# EAGLE design Parasite (EAGLE 9.6.2)
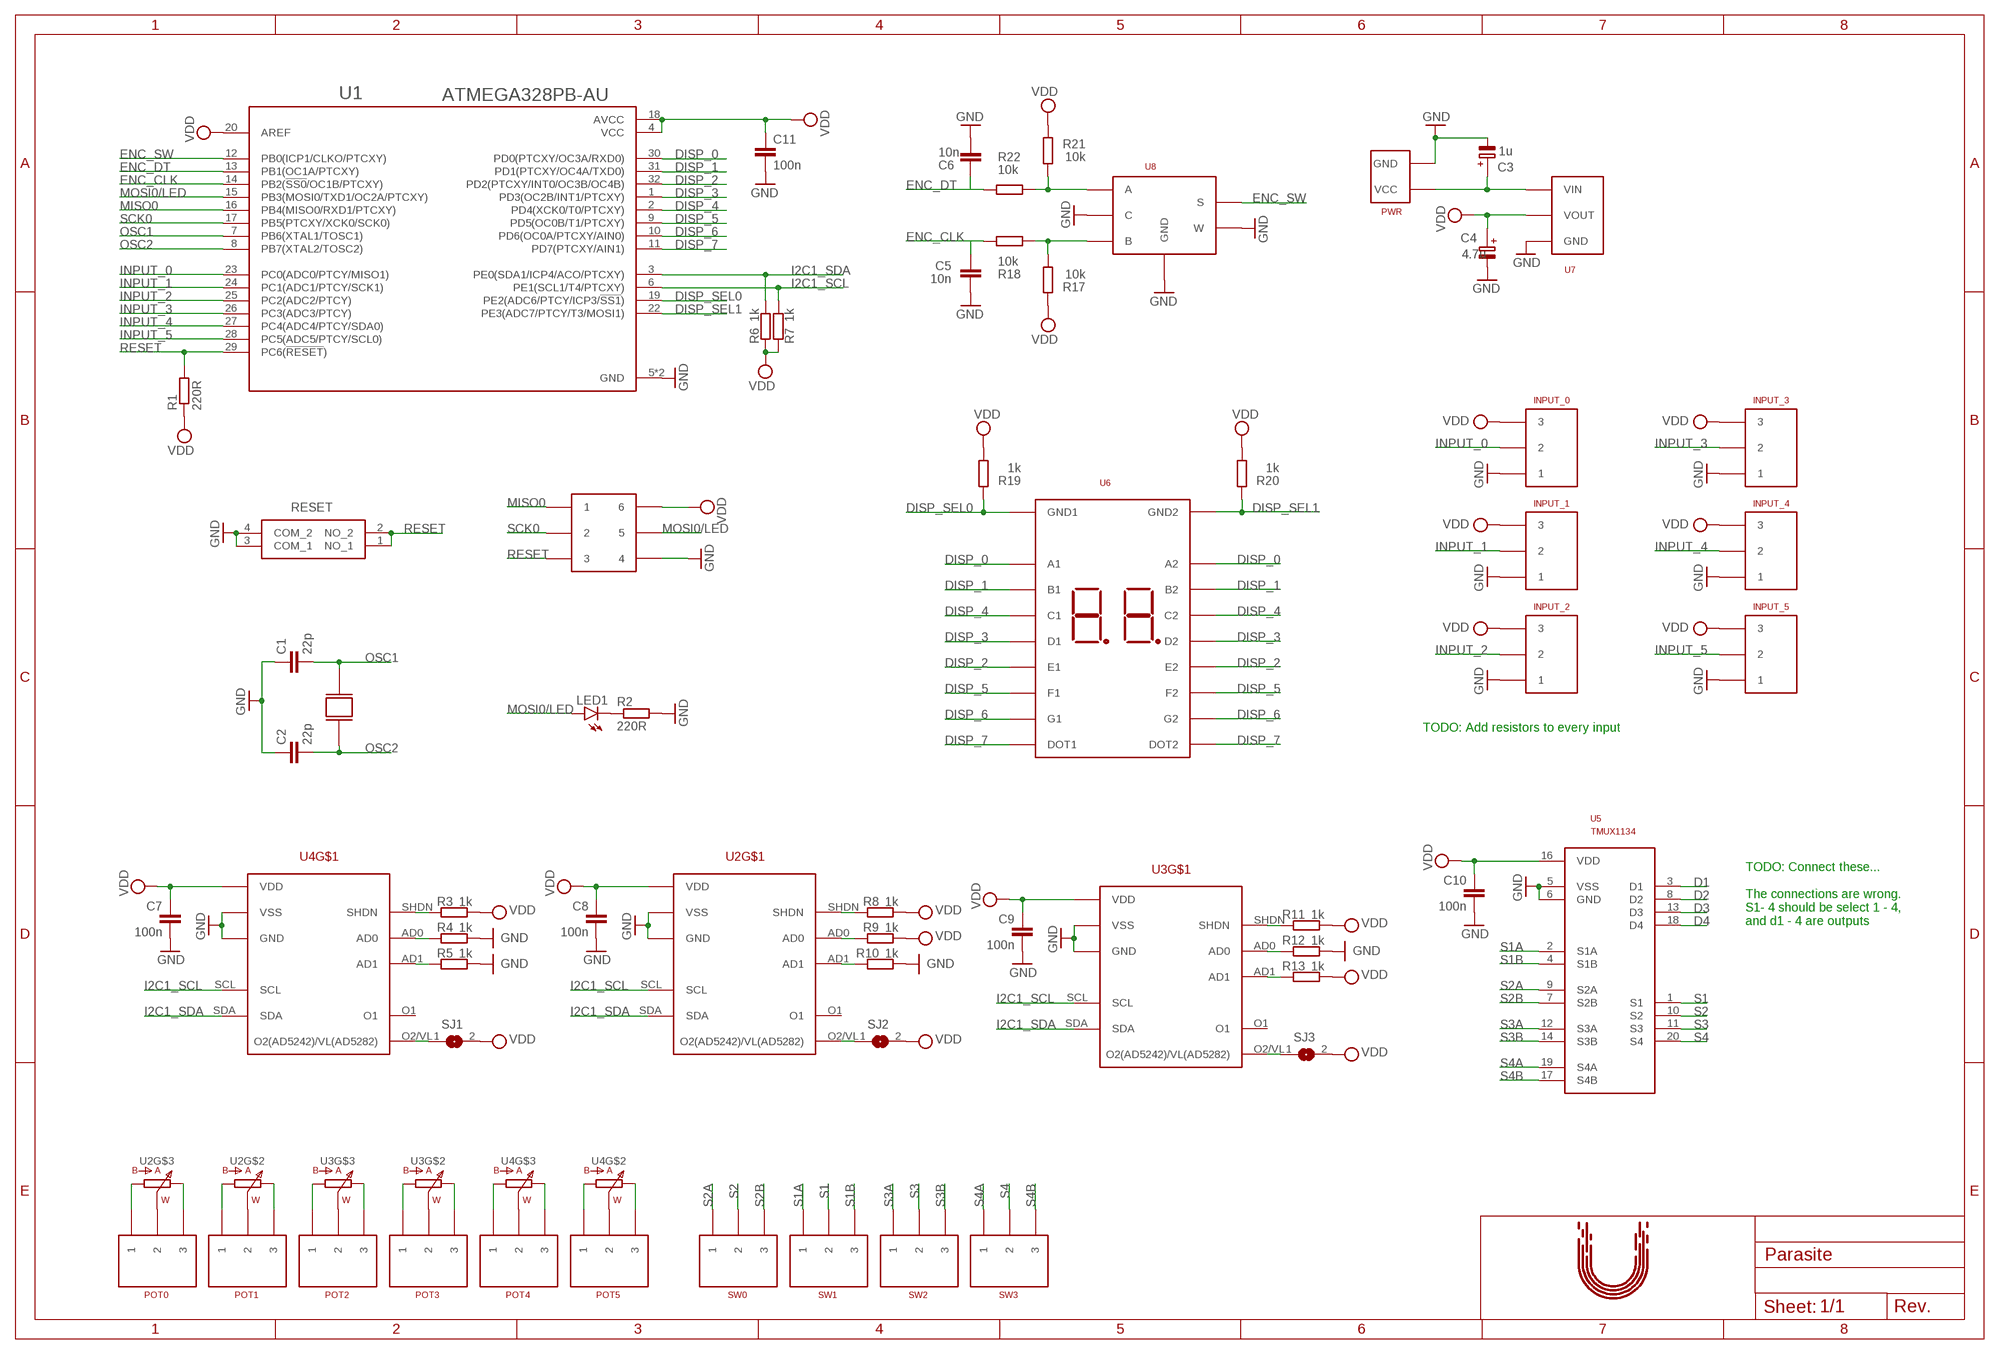
[diagram p0: schematic, sheet 1]

## Parts
C1  22p  CAPACITOR1206  [C-1206]
C2  22p  CAPACITOR1206  [C-1206]
C3  1u  ELECT_CAPACITORCAP6  [UD-4X5,8_NICHICON]
C4  4.7u  ELECT_CAPACITORCAP6  [UD-4X5,8_NICHICON]
C5  10n  CAPACITOR1206  [C-1206]
C6  10n  CAPACITOR1206  [C-1206]
C7  100n  CAPACITOR1206  [C-1206]
C8  100n  CAPACITOR1206  [C-1206]
C9  100n  CAPACITOR1206  [C-1206]
C10  100n  CAPACITOR1206  [C-1206]
C11  100n  CAPACITOR1206  [C-1206]
INPUT_0  3_PIN_CONNECTOR  [3_PIN_CONNECTOR]
INPUT_1  3_PIN_CONNECTOR  [3_PIN_CONNECTOR]
INPUT_2  3_PIN_CONNECTOR  [3_PIN_CONNECTOR]
INPUT_3  3_PIN_CONNECTOR  [3_PIN_CONNECTOR]
INPUT_4  3_PIN_CONNECTOR  [3_PIN_CONNECTOR]
INPUT_5  3_PIN_CONNECTOR  [3_PIN_CONNECTOR]
LED1  LEDLED_THROUGH  [LED3MM]
POT0  3_PIN_CONNECTOR  [3_PIN_CONNECTOR]
POT1  3_PIN_CONNECTOR  [3_PIN_CONNECTOR]
POT2  3_PIN_CONNECTOR  [3_PIN_CONNECTOR]
POT3  3_PIN_CONNECTOR  [3_PIN_CONNECTOR]
POT4  3_PIN_CONNECTOR  [3_PIN_CONNECTOR]
POT5  3_PIN_CONNECTOR  [3_PIN_CONNECTOR]
PWR  PWR  [PWR]
R1  220R  RESISTOR1206  [R1206]
R2  220R  RESISTOR1206  [R1206]
R3  1k  RESISTOR1206  [R1206]
R4  1k  RESISTOR1206  [R1206]
R5  1k  RESISTOR1206  [R1206]
R6  1k  RESISTOR1206  [R1206]
R7  1k  RESISTOR1206  [R1206]
R8  1k  RESISTOR1206  [R1206]
R9  1k  RESISTOR1206  [R1206]
R10  1k  RESISTOR1206  [R1206]
R11  1k  RESISTOR1206  [R1206]
R12  1k  RESISTOR1206  [R1206]
R13  1k  RESISTOR1206  [R1206]
R17  10k  RESISTOR1206  [R1206]
R18  10k  RESISTOR1206  [R1206]
R19  1k  RESISTOR1206  [R1206]
R20  1k  RESISTOR1206  [R1206]
R21  10k  RESISTOR1206  [R1206]
R22  10k  RESISTOR1206  [R1206]
RESET  BUTTON  [PTS647SK38SMTR2LFS]
SJ1  JUMPER  [SJ]
SJ2  JUMPER  [SJ]
SJ3  JUMPER  [SJ]
SW0  3_PIN_CONNECTOR  [3_PIN_CONNECTOR]
SW1  3_PIN_CONNECTOR  [3_PIN_CONNECTOR]
SW2  3_PIN_CONNECTOR  [3_PIN_CONNECTOR]
SW3  3_PIN_CONNECTOR  [3_PIN_CONNECTOR]
U1  ATMEGA328PB-AU  [QFP80P900X900X120-32N]
U2  DIGITAL_POT_AD5242AD5242/AD5282  [SOP65P640X120-16N]
U3  DIGITAL_POT_AD5282AD5242/AD5282  [SOP65P640X120-16N]
U4  DIGITAL_POT_AD5242AD5242/AD5282  [SOP65P640X120-16N]
U5  TMUX1134  [SOP65P640X120-20N]
U6  7_SEGMENT_DISPLAY  [7_SEGMENT_DISPLAY]
U7  VOLTAGE_REGULATOR_LDL1117S50RVOLTAGE_REGULATOR_LDL1117S50R  [SOT230P700X180-4N]
U8  ROTARY_ENCODER  [ENCODER_PEC11H-4220F]
U9  3X2_PINHEADER3X2_PINHEADER  [HDRV6W64P254_2X3_900X508X838B]
U10  CRYSTAL_LFXTAL027946BULKCRYSTAL_LFXTAL027946BULK  [XTAL1140X490X430N]
U$5  UTBULT_DESIGN2  [UD_2]

## Nets
D1: U5.3(D1)
D2: U5.8(D2)
D3: U5.13(D3)
D4: U5.18(D4)
DISP_0: U1.30(PD0(PTCXY/OC3A/RXD0)) U6.A1 U6.A2
DISP_1: U1.31(PD1(PTCXY/OC4A/TXD0)) U6.B1 U6.B2
DISP_2: U1.32(PD2(PTCXY/INT0/OC3B/OC4B)) U6.E1 U6.E2
DISP_3: U1.1(PD3(OC2B/INT1/PTCXY)) U6.D1 U6.D2
DISP_4: U1.2(PD4(XCK0/T0/PTCXY)) U6.C1 U6.C2
DISP_5: U1.9(PD5(OC0B/T1/PTCXY)) U6.F1 U6.F2
DISP_6: U1.10(PD6(OC0A/PTCXY/AIN0)) U6.G1 U6.G2
DISP_7: U1.11(PD7(PTCXY/AIN1)) U6.DOT1 U6.DOT2
DISP_SEL0: R19.1 U1.19(PE2(ADC6/PTCY/ICP3/!SS1!)) U6.GND1
DISP_SEL1: R20.1 U1.22(PE3(ADC7/PTCY/T3/MOSI1)) U6.GND2
ENC_CLK: C5.P$2 R18.2 U1.14(PB2(!SS0!/OC1B/PTCXY))
ENC_DT: C6.P$2 R22.2 U1.13(PB1(OC1A/PTCXY))
ENC_SW: U1.12(PB0(ICP1/CLKO/PTCXY)) U8.S
GND: C1.P$1 C2.P$1 C3.- C4.- C5.P$1 C6.P$1 C7.P$2 C8.P$2 C9.P$2 C10.P$2 C11.P$2 INPUT_0.P$1 INPUT_1.P$1 INPUT_2.P$1 INPUT_3.P$1 INPUT_4.P$1 INPUT_5.P$1 PWR.P$2(GND) R2.2 R4.1 R5.1 R10.1 R12.1 RESET.3(COM_1) RESET.4(COM_2) U1.5(GND) U1.21(GND) U2.GND U2.VSS U3.GND U3.VSS U4.GND U4.VSS U5.5(VSS) U5.6(GND) U7.1(GND) U8.C U8.GND1(GND) U8.GND2(GND) U8.W U9.4
I2C1_SCL: R7.1 U1.6(PE1(SCL1/T4/PTCXY)) U2.SCL U3.SCL U4.SCL
I2C1_SDA: R6.1 U1.3(PE0(SDA1/ICP4/ACO/PTCXY)) U2.SDA U3.SDA U4.SDA
INPUT_0: INPUT_0.P$2 U1.23(PC0(ADC0/PTCY/MISO1))
INPUT_1: INPUT_1.P$2 U1.24(PC1(ADC1/PTCY/SCK1))
INPUT_2: INPUT_2.P$2 U1.25(PC2(ADC2/PTCY))
INPUT_3: INPUT_3.P$2 U1.26(PC3(ADC3/PTCY))
INPUT_4: INPUT_4.P$2 U1.27(PC4(ADC4/PTCY/SDA0))
INPUT_5: INPUT_5.P$2 U1.28(PC5(ADC5/PTCY/SCL0))
MISO0: U1.16(PB4(MISO0/RXD1/PTCXY)) U9.1
MOSI0/LED: LED1.A U1.15(PB3(MOSI0/TXD1/OC2A/PTCXY)) U9.5
N$1: LED1.K(C) R2.1
N$2: R3.2 U4.SHDN
N$3: R4.2 U4.AD0
N$4: R5.2 U4.AD1
N$5: SJ1.1 U4.O2/VL(O2(AD5242)/VL(AD5282))
N$6: R11.2 U3.SHDN
N$7: R8.2 U2.SHDN
N$8: R9.2 U2.AD0
N$9: R10.2 U2.AD1
N$10: SJ2.1 U2.O2/VL(O2(AD5242)/VL(AD5282))
N$11: R12.2 U3.AD0
N$12: R13.2 U3.AD1
N$13: SJ3.1 U3.O2/VL(O2(AD5242)/VL(AD5282))
N$14: POT2.P$2 U3.W2(W)
N$15: POT1.P$2 U2.W1(W)
N$16: POT0.P$2 U2.W2(W)
N$17: POT4.P$2 U4.W2(W)
N$18: POT5.P$2 U4.W1(W)
N$19: POT3.P$2 U3.W1(W)
N$20: POT0.P$3 U2.A2(A)
N$21: POT0.P$1 U2.B2(B)
N$22: POT3.P$1 U3.B1(B)
N$23: POT3.P$3 U3.A1(A)
N$24: POT2.P$1 U3.B2(B)
N$25: POT2.P$3 U3.A2(A)
N$26: POT1.P$1 U2.B1(B)
N$27: POT1.P$3 U2.A1(A)
N$28: POT4.P$3 U4.A2(A)
N$29: POT5.P$3 U4.A1(A)
N$30: POT4.P$1 U4.B2(B)
N$31: POT5.P$1 U4.B1(B)
N$42: C3.+ PWR.P$1(VCC) U7.3(VIN)
N$43: R17.2 R18.1 U8.B
N$45: R21.2 R22.1 U8.A
OSC1: C1.P$2 U1.7(PB6(XTAL1/TOSC1)) U10.2
OSC2: C2.P$2 U1.8(PB7(XTAL2/TOSC2)) U10.1
RESET: R1.2 RESET.1(NO_1) RESET.2(NO_2) U1.29(PC6(!RESET!)) U9.3
S1: SW1.P$2 U5.1(S1)
S1A: SW1.P$1 U5.2(S1A)
S1B: SW1.P$3 U5.4(S1B)
S2: SW0.P$2 U5.10(S2)
S2A: SW0.P$1 U5.9(S2A)
S2B: SW0.P$3 U5.7(S2B)
S3: SW2.P$2 U5.11(S3)
S3A: SW2.P$1 U5.12(S3A)
S3B: SW2.P$3 U5.14(S3B)
S4: SW3.P$2 U5.20(S4)
S4A: SW3.P$1 U5.19(S4A)
S4B: SW3.P$3 U5.17(S4B)
SCK0: U1.17(PB5(PTCXY/XCK0/SCK0)) U9.2
VDD: C4.+ C7.P$1 C8.P$1 C9.P$1 C10.P$1 C11.P$1 INPUT_0.P$3 INPUT_1.P$3 INPUT_2.P$3 INPUT_3.P$3 INPUT_4.P$3 INPUT_5.P$3 R1.1 R3.1 R6.2 R7.2 R8.1 R9.1 R11.1 R13.1 R17.1 R19.2 R20.2 R21.1 SJ1.2 SJ2.2 SJ3.2 U1.4(VCC) U1.18(AVCC) U1.20(AREF) U2.VDD U3.VDD U4.VDD U5.16(VDD) U7.2(VOUT) U7.4(VOUT) U9.6
Unconnected: U2.O1 U3.O1 U4.O1

## Notes on the sheet
- TODO: Add resistors to every input
- TODO: Connect these...
  
  The connections are wrong. 
  S1- 4 should be select 1 - 4,
  and d1 - 4 are outputs

## Library data of the parts
C1 C2 C5-C11 = lib:CAPACITOR: Capacitor
C3 C4 = lib:ELECT_CAPACITOR
INPUT_0 INPUT_1-INPUT_5 POT0 POT1-POT5 SW0 SW1-SW3 = lib:3_PIN_CONNECTOR: Molex 3 pin connector; LINK: https://eu.mouser.com/ProductDetail/Molex/22-23-2037/?qs=52ipEG6BoUGgCTv8s5iZJA%3D%3D; MPN: 22-23-2037; SUPPLIER: Mouser
LED1 = lib:LED
PWR = lib:PWR
R1-R13 R17-R22 = lib:RESISTOR
RESET = lib:BUTTON: PTS647SK50SMTR2LFS Tactile Switches 50mA 12VDC, 2.5N 3.8mm H, G leads; LINK: https://eu.mouser.com/ProductDetail/CK/PTS647SK50SMTR2LFS?qs=PqoDHHvF64%252BlD%252B2POA6piA%3D%3D; MPN: PTS647SK50SMTR2LFS; SUPPLIER: Mouser
SJ1-SJ3 = lib:JUMPER: SMD solder JUMPER
U1 = lib:ATMEGA328PB-AU: ATMEGA328PB-AU ATmega Series 20 MHz 32 KB Flash 2 KB SRAM 8-Bit Microcontroller - TQFP-32; LINK: https://eu.mouser.com/ProductDetail/Microchip-Technology-Atmel/ATMEGA328PB-AU?qs=jy4bLUHv09hbFONgGrqPbw%3D%3D; MPN: ATMEGA328PB-AU; SUPPLIER: Mouser
U2 U4 = lib:DIGITAL_POT_AD5242: Digital Potentiometer AD5242BRUZ1M Digital Potentiometer ICs Dual 8-Bit I2C RDAC; LINK: https://eu.mouser.com/ProductDetail/Analog-Devices/AD5242BRUZ1M/?qs=NmRFExCfTkH%2F0h4IfL5ZXA%3D%3D; MPN: AD5242BRUZ1M; SUPPLIER: Mouser
U3 = lib:DIGITAL_POT_AD5282: Digital Potentiometer AD5282BRUZ50 Digital Potentiometer ICs Dual 8-Bit I2C Dig POT; LINK: https://eu.mouser.com/ProductDetail/Analog-Devices/AD5282BRUZ50/?qs=NmRFExCfTkGPasFgrbTVRw%3D%3D; MPN: AD5282BRUZ50; SUPPLIER: Mouser
U5 = lib:TMUX1134: TMUX1134 TMUX1134 Analog selector 4 Channels 1.08 V to 5.5 V; LINK: https://www.mouser.se/ProductDetail/Texas-Instruments/TMUX1134PWR?qs=%252B6g0mu59x7L8VGQncKsYmQ%3D%3D; MPN: TMUX1134PWR; SUPPLIER: Mouser
U6 = lib:7_SEGMENT_DISPLAY: 7 Segment display LB-602MA2, Green LED Displays & Accessories LED #2 DIGIT DISP .6"CAGRNSHORT LEAD; LINK: https://eu.mouser.com/ProductDetail/ROHM-Semiconductor/LB-602MA2/?qs=hegm%2Fm%252B%2Fz5mYQU7%252BPymz8w%3D%3D; MPN: LB-602MA2; SUPPLIER: Mouser
U7 = lib:VOLTAGE_REGULATOR_LDL1117S50R: 5V Linear voltage regulator LDL1117S50R , LDO Voltage Regulators POWER MANAGEMENT, 2.5-18V to 5V 1.8A; LINK: https://eu.mouser.com/ProductDetail/STMicroelectronics/LDL1117S50R/?qs=AQlKX63v8RsuN9BQFiVf%2Fg%3D%3D; MPN: LDL1117S50R; SUPPLIER: Mouser
U8 = lib:ROTARY_ENCODER: Rotary Encoder Encoders ROTARY ENCODER W/BALL SPRING; LINK: https://eu.mouser.com/ProductDetail/Bourns/PEC11H-4220F-S0024/?qs=7MVldsJ5UayW2mw8xYm74g%3D%3D; MPN: PEC11H-4220F-S0024; SUPPLIER: Mouser
U9 = lib:3X2_PINHEADER; LINK: https://eu.mouser.com/ProductDetail/TE-Connectivity/5-146258-3?qs=lf8um9gOXCICbEgdwHMcdQ%3D%3D; MPN: 5-146258-3; SUPPLIER: Mouser
U10 = lib:CRYSTAL_LFXTAL027946BULK: Crystal 16MHz LFXTAL027946Bulk Crystals 16MHz 22pF -10C 60C; LINK: https://eu.mouser.com/ProductDetail/IQD/LFXTAL027946Bulk?qs=e4%2FAndAAwgLO2zHF2uqREA%3D%3D; MPN: LFXTAL027946Bulk; SUPPLIER: Mouser
U$5 = lib:UTBULT_DESIGN

## Board
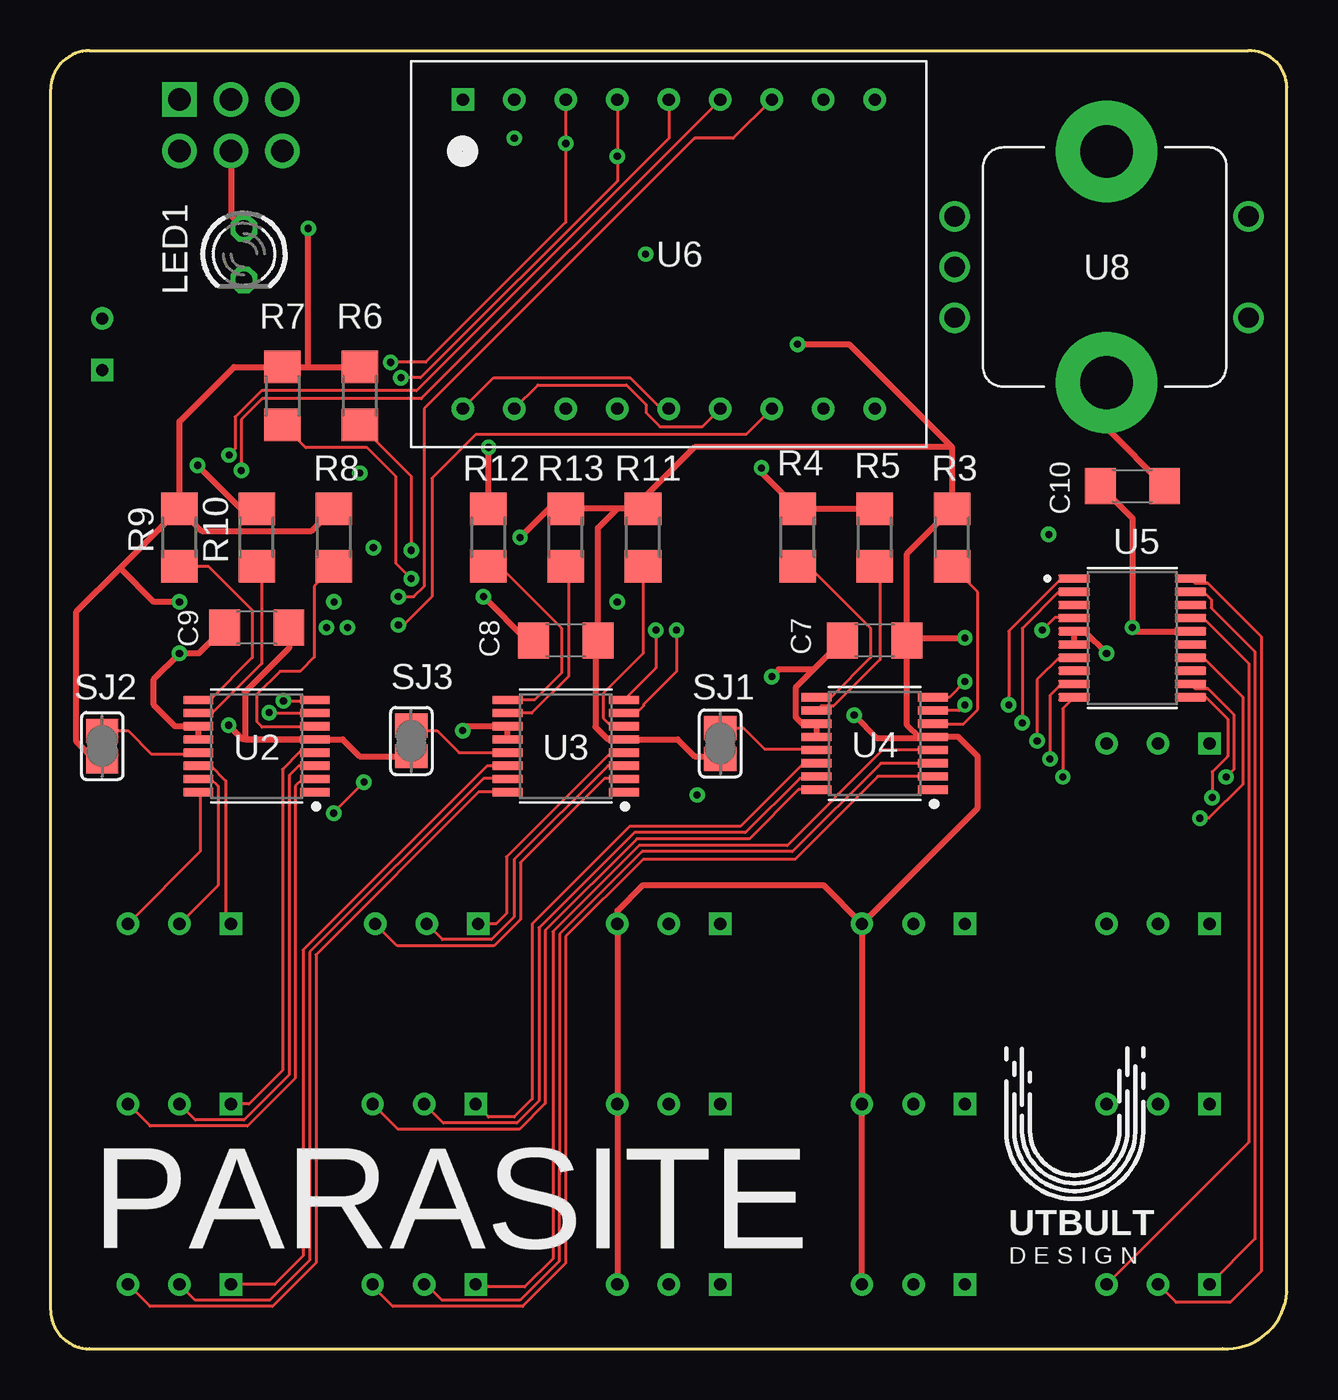
[diagram p1: board, top side]
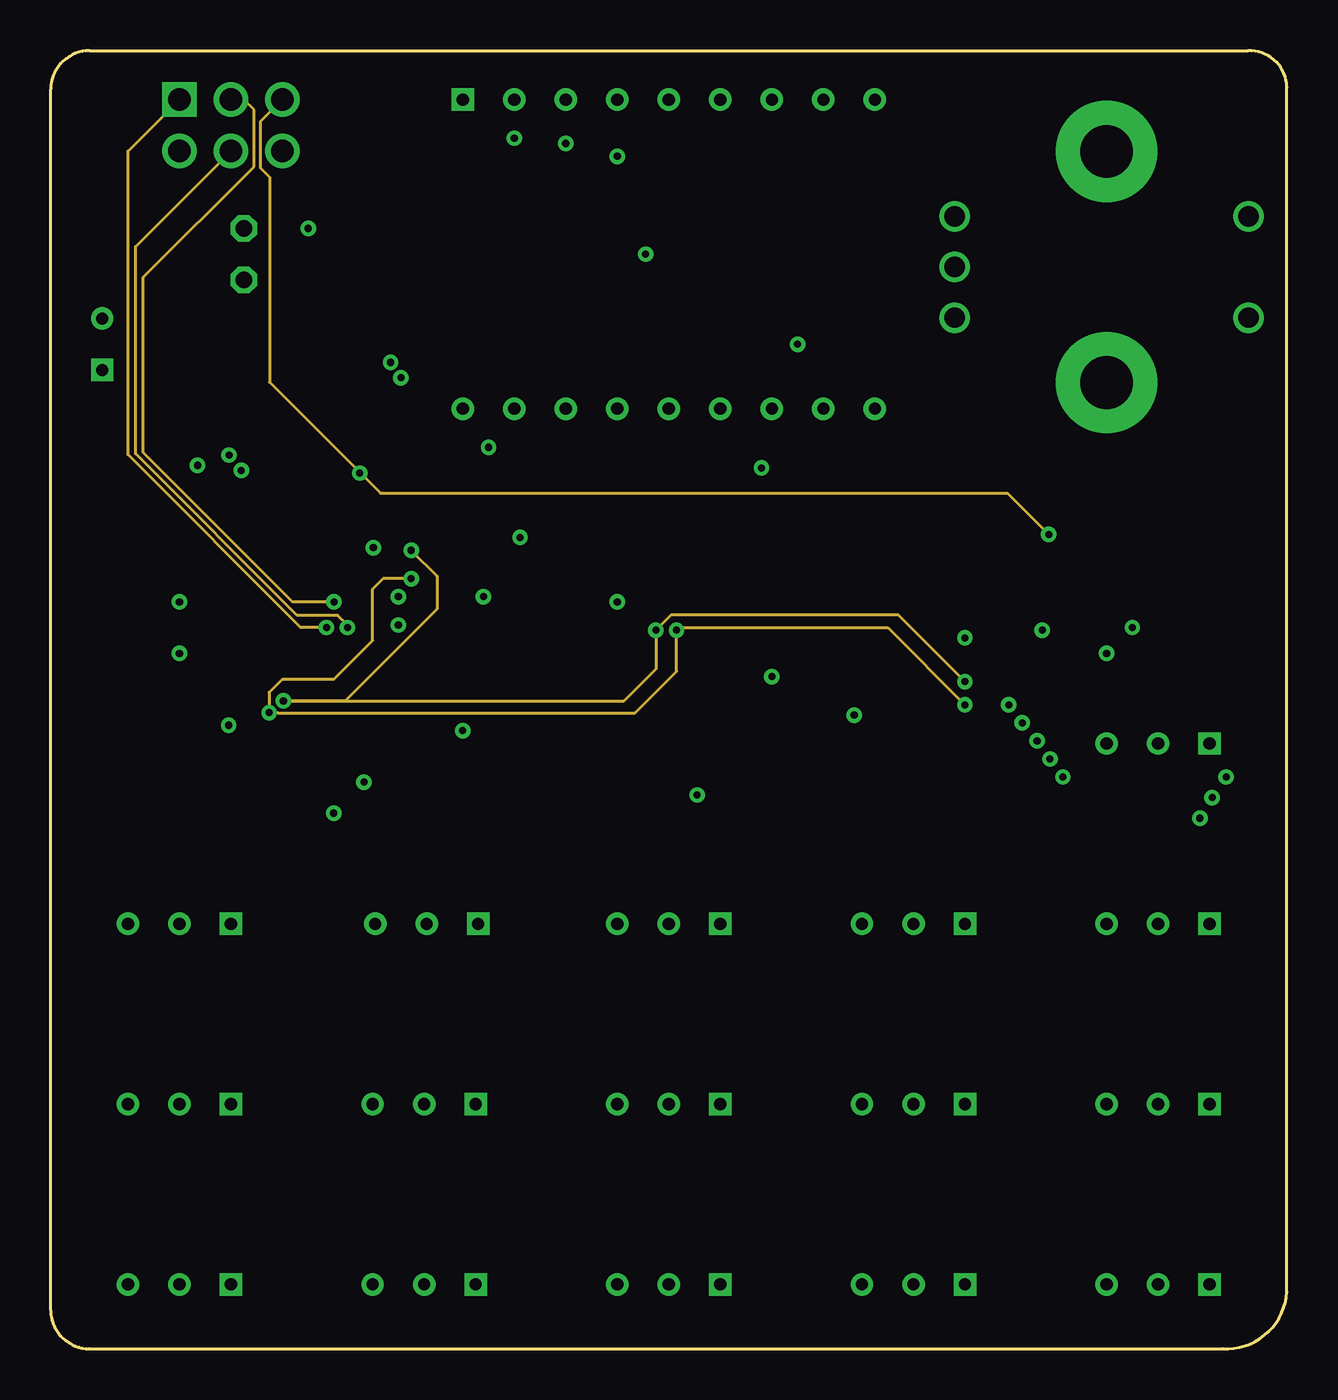
[diagram p2: board, inner layer Route2]
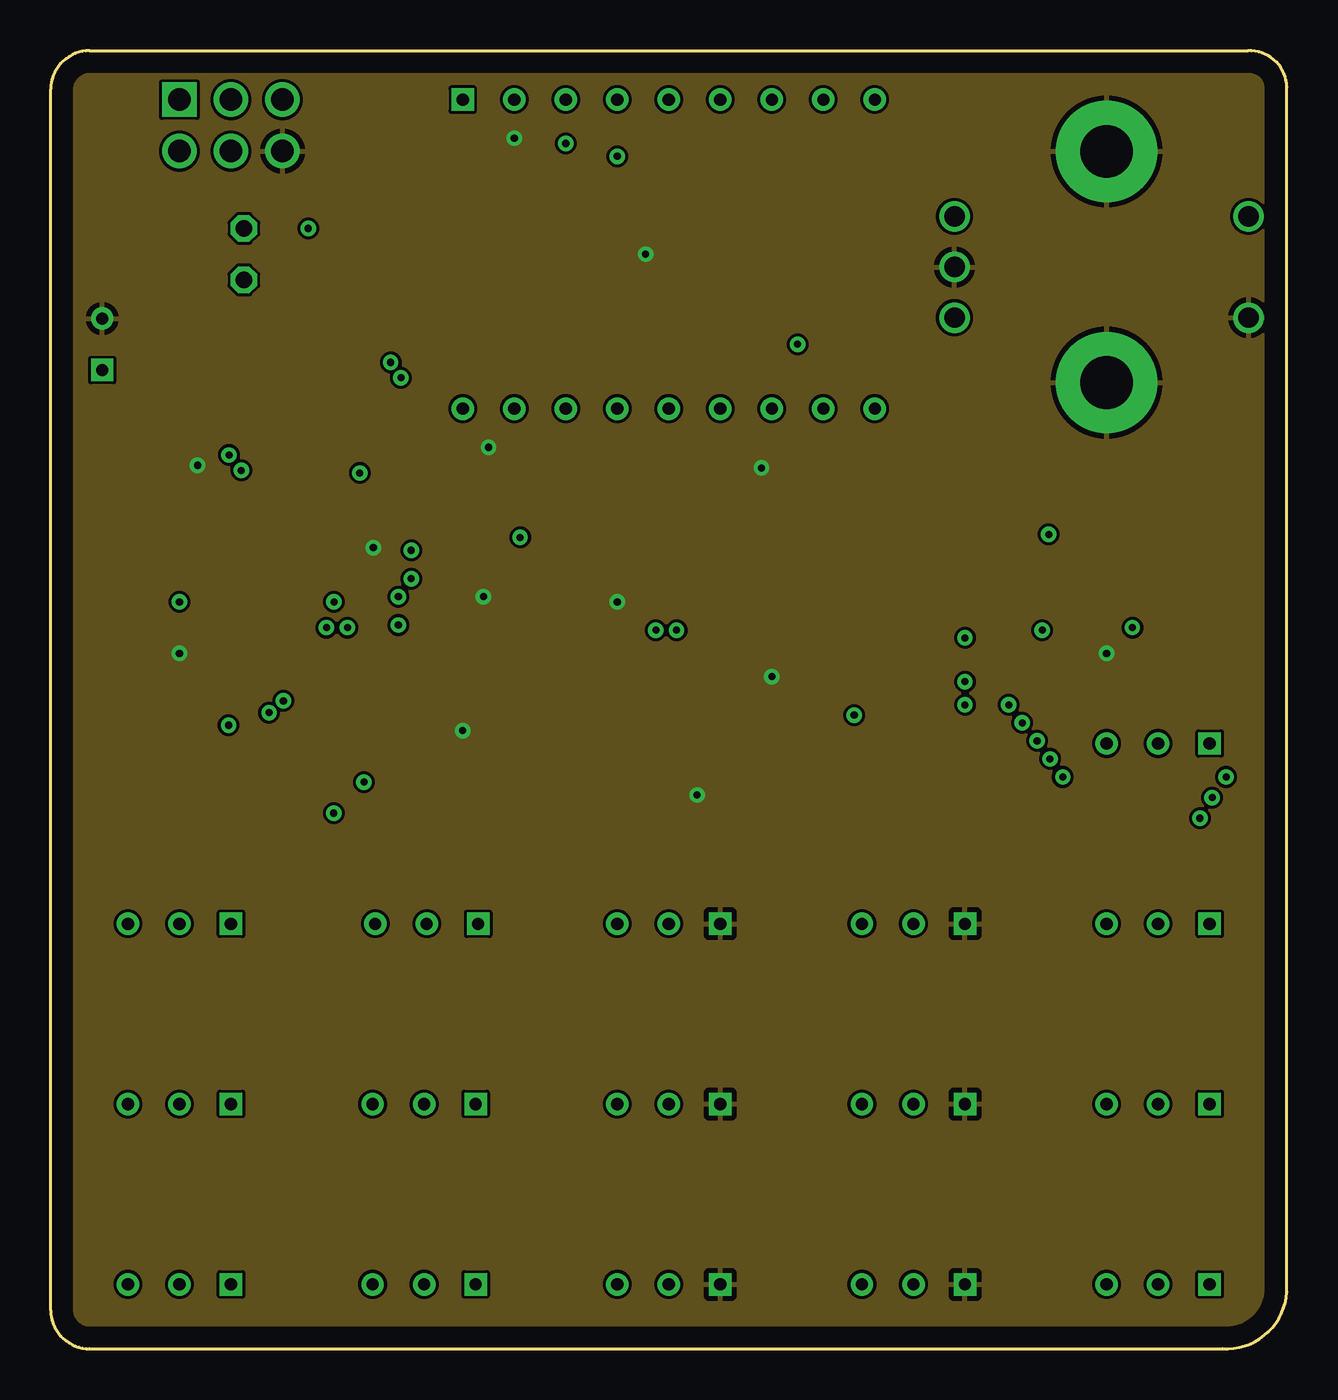
[diagram p3: board, inner layer Route15]
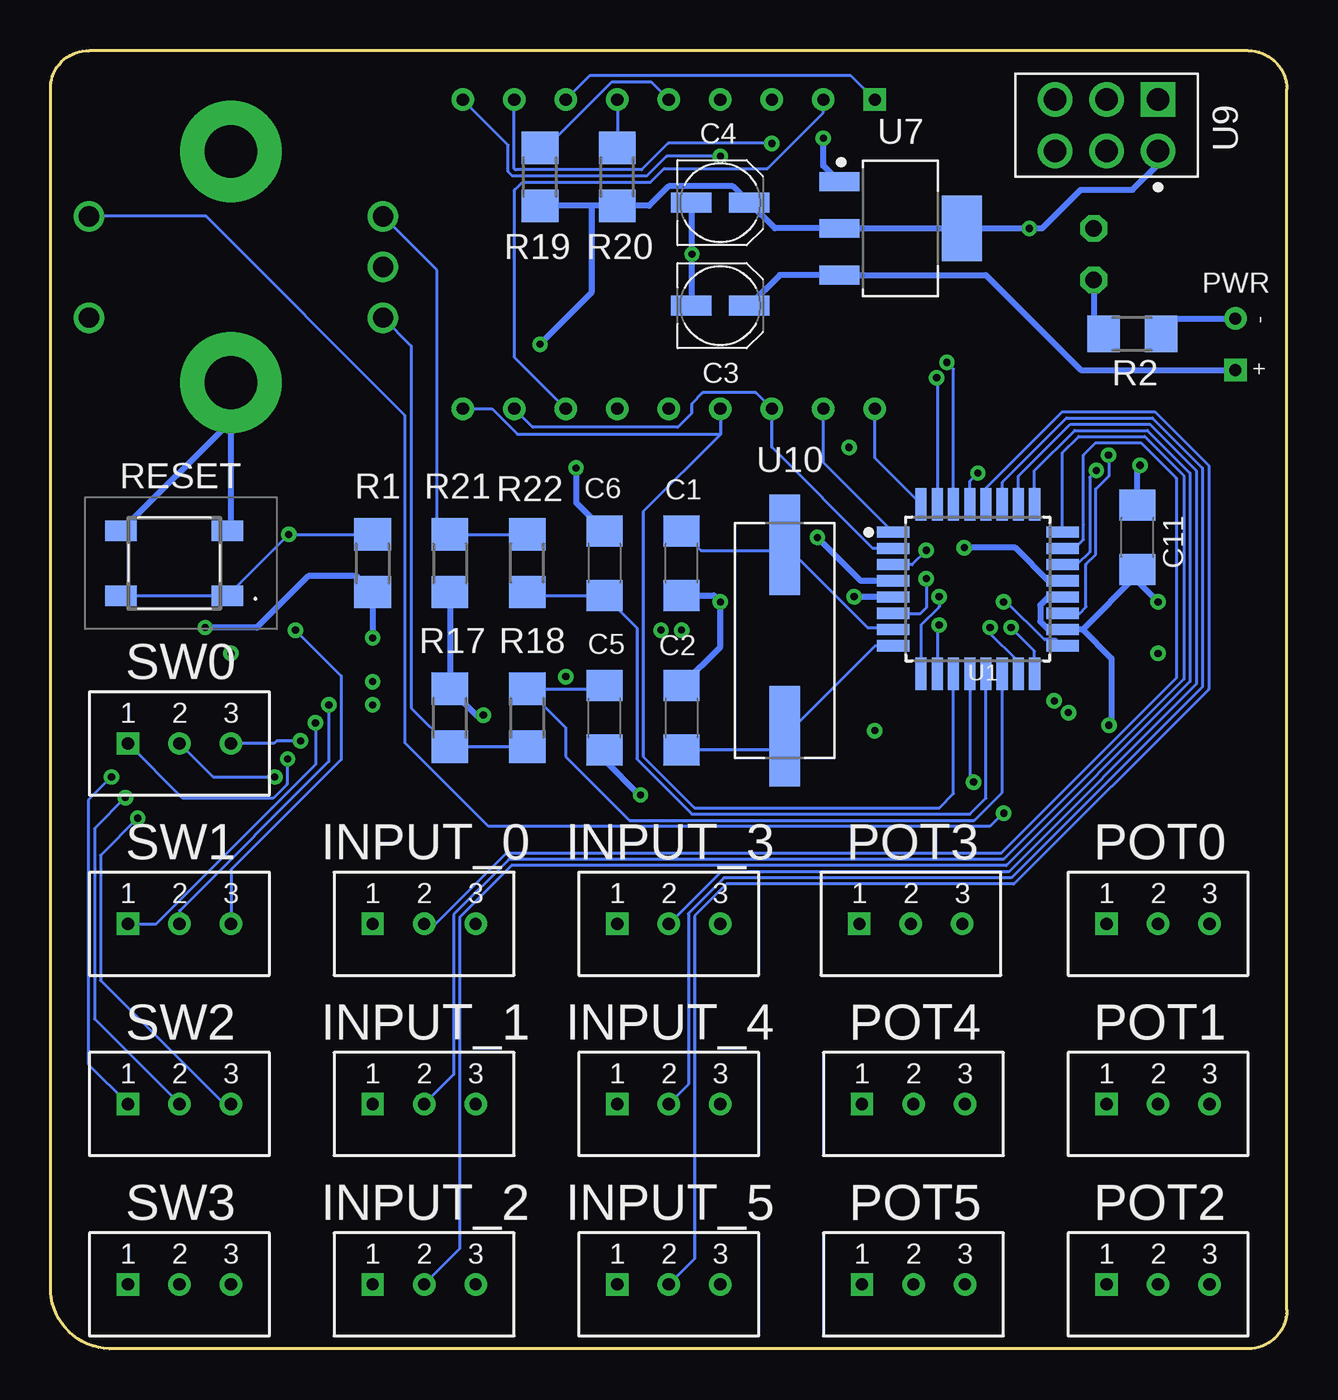
[diagram p4: board, bottom side, seen from below]

Size 60.96 x 64.01 mm. Coordinates in mm from the lower left corner, seen from the top.
Outline: 57.78,0 arc90 60.96,2.8 60.96,62.23 arc90 59.05,64.01 1.91,64.01 arc90 0,62.11 0,1.91 arc90 1.91,0 57.78,0
Copper layers (1+2*15+16): Top 0.035mm / dielectric 1.5mm / Route2 0.035mm / dielectric 0.15mm / Route15 0.035mm / dielectric 0.2mm / Bottom 0.035mm
Design rules "default *": minimum track width 6mil, minimum drill 0.35mm, track to track 6mil, track to pad 6mil, pad to pad 6mil, via to via 6mil, smd to smd 6mil, copper to edge 40mil, drill to drill 6mil, minimum pad ring 10mil, minimum via ring 8mil, stop-mask expansion 4mil, vias tented up to drill 0mil, thermal gap 10mil

### Footprints (pad centres in the part's own frame; a part is rotated, then mirrored left to right if it is on the bottom)
C-1206 = smd 1.524 x 1.778: P$1 -1.587,0; P$2 1.587,0
UD-4X5,8_NICHICON = smd 2 x 1: + 1.425,0; - -1.425,0
3_PIN_CONNECTOR = drill 0.6 square: P$1 -2.54,0 | drill 0.6: P$2 0,0; P$3 2.54,0
LED3MM = drill 0.813 octagon: A -1.27,0; K 1.27,0
PWR = drill 0.6 square: P$1 -1.27,0 | drill 0.6: P$2 1.27,0
R1206 = smd 1.6 x 1.803: 1 -1.422,0; 2 1.422,0
PTS647SK38SMTR2LFS = smd 1.55 x 1: 1 -2.625,1.6; 2 2.625,1.6; 3 -2.625,-1.6; 4 2.625,-1.6
SJ = smd 1.168 x 1.6: 1 -0.762,0; 2 0.762,0
QFP80P900X900X120-32N = smd 1.6 x 0.55: 1 -4.18,2.8; 2 -4.18,2; 3 -4.18,1.2; 4 -4.18,0.4; 5 -4.18,-0.4; 6 -4.18,-1.2; 7 -4.18,-2; 8 -4.18,-2.8; 17 4.18,-2.8; 18 4.18,-2; 19 4.18,-1.2; 20 4.18,-0.4; 21 4.18,0.4; 22 4.18,1.2; 23 4.18,2; 24 4.18,2.8 | smd 0.55 x 1.6: 9 -2.8,-4.18; 10 -2,-4.18; 11 -1.2,-4.18; 12 -0.4,-4.18; 13 0.4,-4.18; 14 1.2,-4.18; 15 2,-4.18; 16 2.8,-4.18; 25 2.8,4.18; 26 2,4.18; 27 1.2,4.18; 28 0.4,4.18; 29 -0.4,4.18; 30 -1.2,4.18; 31 -2,4.18; 32 -2.8,4.18
SOP65P640X120-16N = smd 1.469 x 0.407: A1 -2.871,1.625; A2 2.871,2.275; AD0 2.871,-2.275; AD1 2.871,-1.625; B1 -2.871,0.325; B2 2.871,0.975; GND 2.871,-0.975; O1 -2.871,2.275; O2/VL 2.871,0.325; SCL -2.871,-1.625; SDA -2.871,-2.275; SHDN -2.871,-0.975; VDD -2.871,-0.325; VSS 2.871,-0.325; W1 -2.871,0.975; W2 2.871,1.625
SOP65P640X120-20N = smd 1.57 x 0.41: 1 -2.87,2.925; 2 -2.87,2.275; 3 -2.87,1.625; 4 -2.87,0.975; 5 -2.87,0.325; 6 -2.87,-0.325; 7 -2.87,-0.975; 8 -2.87,-1.625; 9 -2.87,-2.275; 10 -2.87,-2.925; 11 2.87,-2.925; 12 2.87,-2.275; 13 2.87,-1.625; 14 2.87,-0.975; 15 2.87,-0.325; 16 2.87,0.325; 17 2.87,0.975; 18 2.87,1.625; 19 2.87,2.275; 20 2.87,2.925
7_SEGMENT_DISPLAY = drill 0.6: A1 -5.08,7.62; A2 7.62,7.62; B1 -2.54,7.62; B2 10.16,7.62; C1 -5.08,-7.62; C2 7.62,-7.62; D1 -7.62,-7.62; D2 2.54,-7.62; DOT1 -2.54,-7.62; DOT2 10.16,-7.62; E1 -10.16,-7.62; E2 0,-7.62; F2 5.08,7.62; G1 -7.62,7.62; G2 5.08,-7.62; GND1 0,7.62; GND2 2.54,7.62 | drill 0.6 square: F1 -10.16,7.62
SOT230P700X180-4N = smd 1.965 x 0.934: 1 -3.023,2.3; 2 -3.023,0; 3 -3.023,-2.3 | smd 1.965 x 3.234: 4 3.023,0
ENCODER_PEC11H-4220F = drill 1: A -2.5,-7.5; B 2.5,-7.5; C 0,-7.5; S -2.5,7; W 2.5,7 | drill 2.6 pad 5: GND1 -5.7,0; GND2 5.7,0
HDRV6W64P254_2X3_900X508X838B = drill 1.105 pad 1.705 square: 1 0,-2.54 | drill 1.105 pad 1.705: 2 2.54,-2.54; 3 5.08,-2.54; 4 5.08,0; 5 2.54,0; 6 0,0
XTAL1140X490X430N = smd 4.962 x 1.512: 1 -4.725,0; 2 4.725,0

### Placement (x,y rotation side)
C1  29.84,38.74 90 bottom
C2  29.84,31.12 270 bottom
C3  27.94,51.44 0 bottom
C4  27.94,56.52 0 bottom
C5  33.66,31.12 90 bottom
C6  33.66,38.74 270 bottom
C7  40.64,34.93 180 top
C8  25.4,34.93 180 top
C9  10.16,35.56 180 top
C10  53.34,42.55 0 top
C11  7.37,40.01 90 bottom
INPUT_0  42.55,20.96 0 bottom
INPUT_1  42.55,12.07 0 bottom
INPUT_2  42.55,3.18 0 bottom
INPUT_3  30.48,20.96 0 bottom
INPUT_4  30.48,12.07 0 bottom
INPUT_5  30.48,3.18 0 bottom
LED1  9.53,53.98 270 top
POT0  6.35,20.96 0 bottom
POT1  6.35,12.07 0 bottom
POT2  6.35,3.18 0 bottom
POT3  18.54,20.96 0 bottom
POT4  18.41,12.07 0 bottom
POT5  18.41,3.18 0 bottom
PWR  2.54,49.53 90 bottom
R1  45.09,38.74 90 bottom
R2  7.62,50.04 0 bottom
R3  44.45,40.01 270 top
R4  36.83,40.01 270 top
R5  40.64,40.01 270 top
R6  15.24,46.99 90 top
R7  11.43,46.99 90 top
R8  13.97,40.01 270 top
R9  6.35,40.01 270 top
R10  10.16,40.01 270 top
R11  29.21,40.01 270 top
R12  21.59,40.01 270 top
R13  25.4,40.01 270 top
R17  41.27,31.12 270 bottom
R18  37.47,31.12 90 bottom
R19  36.83,57.79 270 bottom
R20  33.02,57.79 270 bottom
R21  41.27,38.74 90 bottom
R22  37.47,38.74 270 bottom
RESET  54.86,38.74 180 bottom
SJ1  33.02,29.85 270 top
SJ2  2.54,29.72 270 top
SJ3  17.78,29.98 270 top
SW0  54.61,29.85 0 bottom
SW1  54.61,20.96 0 bottom
SW2  54.61,12.07 0 bottom
SW3  54.61,3.18 0 bottom
U1  15.24,37.47 0 bottom
U2  10.16,29.72 180 top
U3  25.4,29.72 180 top
U4  40.64,29.85 180 top
U5  53.34,35.06 0 top
U6  30.48,53.98 0 top
U7  19.05,55.25 0 bottom
U8  52.07,53.34 270 top
U9  6.35,59.06 180 bottom
U10  24.77,34.93 90 bottom
U$5  50.42,11.18 0 top

### Tracks (layer width: path | path; a pad name or v marks a point on that pad's centre or on a via)
DISP_0  (via drill 0.35)
  Top 0.152: U6.A1 v25.4,59.44 25.4,55.55 18.49,48.65 v16.76,48.65
  Bottom 0.152: v16.76,48.65 16.44,48.32 U1.30 | U6.A2 38.1,58.2 38.03,58.13 31.82,58.13 30.51,59.44 v25.4,59.44
DISP_1  (via drill 0.35)
  Top 0.152: U6.B1 v27.94,58.81 27.94,57.59 18.24,47.88 v17.27,47.88
  Bottom 0.152: v27.94,58.81 30.59,58.81 31.57,57.83 38.19,57.83 38.41,58.04 38.41,59.36 U6.B2 | v17.27,47.88 17.24,47.85 U1.31
DISP_2
  Top 0.152: U6.E1 21.84,47.88 28.57,47.88 30.1,46.36 U6.E2
  Bottom 0.152: U1.32 20.32,43.93 U6.E1
DISP_3
  Top 0.152: U6.D1 24.02,47.52 28.39,47.52 29.36,46.56 29.36,46.16 30.04,45.47 32.13,45.47 U6.D2
  Bottom 0.152: U1.1 22.86,43.71 U6.D1
DISP_4
  Bottom 0.152: U1.2 20.41,39.47 25.4,44.45 U6.C1 26.18,47.14 28.81,47.14 29.36,46.6 29.36,46.12 30.03,45.45 37.19,45.45 U6.C2
DISP_5  (via drill 0.35)
  Top 0.152: U6.F2 33.66,59.69 31.75,59.69 18.41,46.36 18.41,37.6 17.91,37.09 v17.14,37.09
  Bottom 0.152: U6.F1 21.49,62.77 34.39,62.77 U6.F2 | v17.14,37.09 17.14,36.58 18.04,35.69 U1.9
DISP_6  (via drill 0.35)
  Top 0.152: U6.G2 34.29,45.09 20.95,45.09 18.8,42.93 18.8,37.09 17.4,35.69 v17.14,35.69
  Bottom 0.152: v17.14,35.69 17.24,35.6 U1.10 | U6.G1 22.86,60.96 25.63,58.2 30.71,58.2 31.38,57.52 37.7,57.52 38.07,57.15 38.1,57.15 38.1,48.9 U6.G2
DISP_7
  Bottom 0.152: U6.DOT1 27.94,45.09 | U1.11 16.44,27.38 17.14,26.67 29.21,26.67 31.75,29.21 31.75,41.28 27.94,45.09 | U6.DOT2 39.21,46.36 37.94,45.09 27.93,45.09 27.94,45.09
DISP_SEL0  (via drill 0.35)
  Top 0.152: U6.GND1 30.48,59.69 18.03,47.25 10.4,47.25 9.09,45.95 9.09,44.38 v8.79,44.07
  Bottom 0.152: v8.79,44.07 8.76,44.05 8.76,43.06 9.42,42.4 9.42,39.17 9.91,38.69 9.91,36.58 10.22,36.27 U1.19 | U6.GND1 31.34,62.46 33.3,62.46 36.55,59.21 R19.1
DISP_SEL1  (via drill 0.35)
  Top 0.152: U6.GND2 18.28,46.86 10.43,46.86 9.4,45.82 v9.4,43.31
  Bottom 0.152: U1.22 10.36,38.67 9.73,39.3 9.73,42.98 v9.4,43.31 | U6.GND2 R20.1
ENC_CLK
  Bottom 0.152: C5.P$2 33.82,32.54 R18.2 35.56,30.64 35.56,29.21 32.41,26.06 15.42,26.06 14.04,27.44 U1.14
ENC_DT
  Bottom 0.152: R22.2 37.3,37.15 C6.P$2 32.05,35.55 32.05,29.09 29.34,26.37 15.62,26.37 14.84,27.15 U1.13
ENC_SW  (via drill 0.35)
  Top 0.152: v15.45,27.94 13.96,26.46 v13.96,26.41
  Bottom 0.152: U1.12 15.64,28.14 v15.45,27.94 | v13.96,26.41 14.01,26.41 14.66,25.76 39.36,25.76 43.48,29.88 43.48,46.03 53.3,55.84 U8.S
GND  (via drill 0.35)
  Top 0.305: R12.1 v21.59,44.45 | R5.1 R4.1 35.05,43.21 v35.05,43.44 | R10.1 9.37,41.43 v7.24,43.57 | C8.P$2 23.5,34.93 v21.34,37.09 | U3.VSS U3.GND 20.53,30.7 v20.32,30.48 | C10.P$2 52.07,45.41 U8.GND2 | U5.6 U5.5 50.98,35.38 v52.07,34.29 | C7.P$2 37.62,33.5 | 37.62,33.5 36.73,32.61 36.73,31.14 37.05,30.82 U4.GND U4.VSS | 37.62,33.5 35.91,33.5 v35.56,33.15 | C9.P$2 7.3,34.29 v6.35,34.29 5.08,33.02 5.08,31.75 6.14,30.7 U2.GND U2.VSS
  Bottom 0.305: C3.- 29.34,51.47 v29.34,53.98 29.36,54.01 C4.- | U7.1 22.86,58.34 v22.86,59.69 | C11.P$2 7.37,43.44 v7.24,43.57 | RESET.4 52.07,45.76 | 52.07,45.76 U8.GND2 | RESET.3 52.07,40.51 52.07,45.76 | v35.05,43.44 35.05,41.72 C6.P$1 | C1.P$1 28.26,37.15 v27.94,36.83 27.94,34.61 C2.P$1 | U1.5 21.32,37.07 v21.34,37.09 | U1.21 11.09,37.84 11.73,37.84 13.4,39.5 v15.91,39.5 | C5.P$1 33.66,29.02 31.94,27.31 v31.88,27.31 | R2.2 5.44,50.8 PWR.P$2
  pour Route15: 0,64.01 60.96,64.01 60.96,0 0,0
I2C1_SCL  (via drill 0.35)
  Top 0.152: v17.78,37.98 17.02,38.74 17.02,43.02 15.61,44.43 12.57,44.43 R7.1 | v10.77,31.37 10.8,31.35 U2.SCL | v30.86,35.44 30.86,33.41 29.23,31.78 29.23,31.7 28.88,31.35 U3.SCL | v45.09,31.75 44.8,31.47 U4.SCL
  Route2 0.152: v17.78,37.98 16.38,37.98 15.88,37.47 15.88,34.93 13.97,33.02 11.43,33.02 10.77,32.36 v10.77,31.37 11.2,31.37 11.22,31.35 28.8,31.35 30.86,33.41 v30.86,35.44 30.99,35.56 41.27,35.56 v45.09,31.75
  Bottom 0.152: v17.78,37.98 17.78,36.55 18.06,36.27 U1.6
I2C1_SDA  (via drill 0.35)
  Top 0.152: R6.1 17.78,43.03 v17.78,39.37 | v11.47,31.95 12.99,31.95 U2.SDA | v29.84,35.44 29.84,33.57 U3.SDA | v45.09,32.9 44.31,32.12 U4.SDA
  Route2 0.152: v17.78,39.37 19.05,38.1 19.05,36.48 14.52,31.95 v11.47,31.95 28.27,31.95 29.84,33.53 v29.84,35.44 30.61,36.2 41.78,36.2 v45.09,32.9
  Bottom 0.152: v17.78,39.37 18.48,38.67 U1.3
INPUT_0
  Bottom 0.152: U1.23 11.02,39.51 10.42,39.51 10.03,39.9 10.03,40.64 10.03,44.07 9.42,44.68 7.21,44.68 5.46,42.94 5.46,33.07 14.1,24.44 38.49,24.44 41.97,20.96 INPUT_0.P$2
INPUT_1
  Bottom 0.152: U1.24 11.06,44.19 10.26,44.99 7.01,44.99 5.08,43.06 5.08,33.02 13.97,24.13 38.37,24.13 41.09,21.41 41.09,13.52 INPUT_1.P$2
INPUT_2
  Bottom 0.152: U1.25 12.44,43.32 10.47,45.29 6.88,45.29 4.78,43.18 4.78,32.9 13.84,23.83 38.24,23.83 40.79,21.28 40.79,4.94 INPUT_2.P$2
INPUT_3
  Bottom 0.152: U1.26 13.24,43.03 10.67,45.59 6.75,45.59 4.47,43.31 4.47,32.77 13.72,23.52 27.91,23.52 INPUT_3.P$2
INPUT_4
  Bottom 0.152: U1.27 14.04,42.73 10.87,45.9 6.63,45.9 4.17,43.44 4.17,32.65 13.59,23.22 27.76,23.22 29.52,21.47 29.52,13.03 INPUT_4.P$2
INPUT_5
  Bottom 0.152: U1.28 14.84,42.44 11.08,46.2 6.5,46.2 3.86,43.56 3.86,32.52 13.46,22.92 27.64,22.92 29.21,21.34 29.21,4.45 INPUT_5.P$2
MISO0  (via drill 0.35)
  Route2 0.152: v13.6,35.56 12.33,35.56 3.81,44.08 3.81,59.06 U9.1
  Bottom 0.152: U1.16 12.44,34.41 v13.6,35.56
MOSI0/LED  (via drill 0.35)
  Top 0.305: U9.5 8.89,55.88 LED1.A
  Route2 0.152: v14.63,35.56 v14.64,35.57 14.64,35.69 14.16,36.17 12.15,36.17 4.19,44.13 4.19,54.36 U9.5
  Bottom 0.152: U1.15 13.28,33.33 13.28,33.93 14.63,35.28 v14.63,35.56
N$1
  Bottom 0.305: LED1.K 9.53,50.53 R2.1
N$2
  Top 0.152: R3.2 45.72,37.32 45.72,31.53 44.98,30.79 43.55,30.79 U4.SHDN
N$3
  Top 0.152: R4.2 37.37,38.59 40.42,35.53 40.42,34.08 38.47,32.12 U4.AD0
N$4
  Top 0.152: U4.AD1 37.99,31.69 38.6,31.69 40.89,33.99 40.89,38.33 R5.2
N$5
  Top 0.152: SJ1.1 34.16,30.61 35.21,29.56 37.73,29.56 U4.O2/VL
N$6
  Top 0.152: R11.2 29.21,34.29 27.24,32.33 27.24,31.12 27.66,30.7 U3.SHDN
N$7
  Top 0.152: U2.SHDN 12.99,30.66 10.42,30.66 10.16,30.93 10.16,32.26 11.3,33.41 12.29,33.41 12.99,34.11 12.99,37.61 R8.2
N$8
  Top 0.152: R9.2 7.78,38.59 9.94,36.42 9.94,34.08 7.86,32 U2.AD0
N$9
  Top 0.152: U2.AD1 7.97,31.35 10.41,33.79 10.41,38.33 R10.2
N$10
  Top 0.152: SJ2.1 3.81,30.48 4.95,29.34 7.23,29.34 U2.O2/VL
N$11
  Top 0.152: R12.2 22.13,38.59 25.18,35.53 25.18,33.32 23.86,32 U3.AD0
N$12
  Top 0.152: R13.2 25.53,38.46 25.53,33.15 23.72,31.35 U3.AD1
N$13
  Top 0.152: SJ3.1 18.03,30.48 19.05,30.48 20.14,29.4 U3.O2/VL
N$14
  Top 0.152: U3.W2 22.49,28.13 21.35,28.13 12.78,19.56 12.78,4.36 10.81,2.4 7.13,2.4 POT2.P$2
N$15
  Top 0.152: U2.W1 12.23,28.75 11.76,28.27 11.76,13.51 9.54,11.29 7.13,11.29 POT1.P$2
N$16
  Top 0.152: 6.71,28.13 7.25,28.13 U2.W2 7.33,28.13 7.86,28.13 8.25,27.75 8.25,22.86 POT0.P$2
  Bottom 0.152: 6.33,20.98 POT0.P$2
N$17
  Top 0.152: U4.W2 37.68,28.13 36.94,28.13 34.26,25.46 28.78,25.46 24.08,20.75 24.08,12.22 22.99,11.13 19.36,11.13 POT4.P$2
N$18
  Top 0.152: U4.W1 40.94,28.87 36.58,24.52 29.16,24.52 25.09,20.45 25.09,8.89 | 25.09,8.89 25.09,8.59 | 25.09,8.89 25.07,8.87 25.07,4.32 23.14,2.4 19.29,2.4 18.51,3.18 POT5.P$2
N$19
  Top 0.152: 27.94,28.78 28.23,28.78 U3.W1 27.47,28.75 22.86,24.13 22.86,21.31 21.73,20.18 19.32,20.18 POT3.P$2
N$20
  Top 0.152: POT0.P$3 7.37,24.52 7.37,27.37 U2.A2
N$21
  Top 0.152: 6.71,28.78 7.25,28.78 U2.B2 7.33,28.78 7.86,28.78 8.64,28.01 8.64,21.21 POT0.P$1
N$22
  Top 0.152: 27.7,29.43 28.23,29.43 U3.B1 28.21,29.34 27.56,29.34 22.48,24.26 22.48,21.47 21.97,20.96 POT3.P$1
N$23
  Top 0.152: U3.A1 28.23,28.13 27.32,28.13 23.16,23.98 23.16,21.18 21.86,19.87 17.09,19.87 POT3.P$3
N$24
  Top 0.152: U3.B2 21.53,28.75 12.45,19.66 12.45,4.58 11.05,3.18 POT2.P$1
N$25
  Top 0.152: U3.A2 21.09,27.45 13.08,19.44 13.08,4.24 10.94,2.09 4.9,2.09 POT2.P$3
N$26
  Top 0.152: U2.B1 12.99,29.43 12.28,29.43 11.43,28.58 11.43,13.72 9.78,12.07 POT1.P$1
N$27
  Top 0.152: U2.A1 12.99,28.13 12.46,28.13 12.06,27.74 12.06,13.34 9.71,10.98 4.9,10.98 POT1.P$3
N$28
  Top 0.152: U4.A2 36.88,27.57 34.46,25.15 28.91,25.15 24.38,20.63 24.38,12.1 23.11,10.82 17.12,10.82 POT4.P$3
N$29
  Top 0.152: U4.A1 40.79,28.22 36.7,24.13 29.21,24.13 25.4,20.32 25.4,4.22 23.27,2.09 16.87,2.09 15.88,3.09 POT5.P$3
N$30
  Top 0.152: U4.B2 37.12,28.87 34.01,25.76 28.55,25.76 23.75,20.96 23.75,19.05 23.75,18.67 23.75,12.32 22.86,11.43 21.59,11.43 POT4.P$1
N$31
  Top 0.152: U4.B1 41.03,29.52 36.32,24.82 29.01,24.82 24.77,20.58 24.77,4.45 23.37,3.05 21.08,3.05 POT5.P$1
N$42
  Bottom 0.305: PWR.P$1 10.16,48.26 14.85,52.95 U7.3 25,52.95 C3.+
N$43
  Bottom 0.152: U8.B 43.18,49.45 43.18,31.6 R17.2 R18.1
N$45
  Bottom 0.152: R22.1 R21.2 41.91,40.8 41.91,53.18 U8.A
OSC1
  Bottom 0.152: C1.P$2 28.89,39.37 25.05,39.37 U10.2 20.68,35.56 19.52,35.56 U1.7
OSC2
  Bottom 0.152: C2.P$2 25.44,29.53 U10.1 20.3,34.67 U1.8
RESET  (via drill 0.35)
  Route2 0.152: v15.24,43.18 15.27,43.18 | 15.27,43.18 16.26,42.2 47.18,42.2 v49.22,40.16 | U9.3 10.34,60.51 10.34,58.23 10.79,57.78 10.79,47.66 15.27,43.18
  Bottom 0.152: RESET.2 RESET.1 v49.22,40.16 R1.2 | U1.29 15.64,42.78 v15.24,43.18
S1  (via drill 0.35)
  Top 0.152: U5.1 50.43,38.02 49.87,38.02 47.24,35.39 v47.24,31.75
  Bottom 0.152: v47.24,31.75 47.24,28.96 54.61,21.59 SW1.P$2
S1A  (via drill 0.35)
  Top 0.152: U5.2 50.43,37.37 49.75,37.37 47.91,35.53 v47.91,30.87
  Bottom 0.152: v47.91,30.87 47.91,28.81 55.75,20.96 SW1.P$1
S1B  (via drill 0.35)
  Top 0.152: U5.4 50.43,36.07 49.53,36.07 v48.9,35.44
  Bottom 0.152: v48.9,35.44 46.64,33.18 46.64,29.06 52.07,23.63 SW1.P$3
S2  (via drill 0.35)
  Top 0.152: U5.10 49.91,31.57 v49.91,28.2
  Bottom 0.152: SW0.P$2 52.96,28.2 v49.91,28.2
S2A  (via drill 0.35)
  Top 0.152: U5.9 50.43,32.82 49.87,32.82 49.28,32.22 v49.28,29.09
  Bottom 0.152: v49.28,29.09 49.3,29.06 49.3,27.84 50,27.14 54.45,27.14 SW0.P$1
S2B  (via drill 0.35)
  Top 0.152: v48.64,29.98 48.64,32.99 49.77,34.12 50.43,34.12 U5.7
  Bottom 0.152: v48.64,29.98 49.81,29.98 49.94,29.85 SW0.P$3
S3  (via drill 0.35)
  Top 0.152: U5.11 56.97,32.13 58.04,31.06 58.04,29.21 57.28,28.45 v57.28,27.18
  Bottom 0.152: v57.28,27.18 58.8,25.66 58.8,16.26 SW2.P$2
S3A  (via drill 0.35)
  Top 0.152: U5.12 56.43,32.57 57.06,32.57 58.35,31.28 58.35,28.58 v57.97,28.2
  Bottom 0.152: v57.97,28.2 59.11,27.06 59.11,14.03 SW2.P$1
S3B  (via drill 0.35)
  Top 0.152: U5.14 56.25,34.12 56.81,34.12 58.78,32.15 58.78,27.82 57.12,26.17 v56.67,26.17
  Bottom 0.152: v56.67,26.17 58.5,24.34 58.5,18.17 52.4,12.07 SW2.P$3
S4
  Top 0.152: U5.20 56.43,37.77 57.06,37.77 59.69,35.13 59.69,3.81 58.17,2.29 55.5,2.29 SW3.P$2
S4A
  Top 0.152: U5.19 56.25,37.37 56.81,37.37 57.22,36.95 57.22,36.54 59.38,34.38 59.38,5.41 SW3.P$1
S4B
  Top 0.152: U5.17 56.84,36.03 59.08,33.79 59.08,10.19 SW3.P$3
SCK0  (via drill 0.35)
  Route2 0.152: v13.97,36.83 11.92,36.83 4.57,44.18 4.57,52.84 10.03,58.3 10.03,61.09 9.53,61.6 U9.2
  Bottom 0.152: U1.17 11.36,34.97 11.96,34.97 13.82,36.83 v13.97,36.83
VDD  (via drill 0.35)
  Top 0.305: 12.7,48.42 R7.2 9.04,48.42 6.35,45.72 R9.1 | 12.7,48.42 R6.2 | 12.7,48.42 v12.7,55.25 | INPUT_5.P$3 INPUT_4.P$3 INPUT_3.P$3 27.94,21.59 29.21,22.86 38.1,22.86 INPUT_0.P$3 | INPUT_2.P$3 INPUT_1.P$3 INPUT_0.P$3 | C9.P$1 11.75,34.55 9.59,32.39 9.59,30.05 U2.VDD | U2.VDD 14.41,30.05 15.24,29.21 SJ3.2 | v36.83,49.53 39.37,49.53 44.45,44.45 | 44.45,44.45 R3.1 42.23,39.21 C7.P$1 | 44.45,44.45 31.75,44.45 29.21,41.91 R11.1 27.94,41.43 | 27.94,41.43 R13.1 24.57,41.43 v23.15,40.01 | R9.1 7.46,40.33 12.87,40.33 R8.1 | INPUT_0.P$3 45.72,26.67 45.72,29.21 44.76,30.17 U4.VDD 43.5,30.19 42.78,30.19 | 42.78,30.19 42.86,30.1 40.77,30.1 v39.62,31.25 | C7.P$1 42.23,30.74 42.78,30.19 | U5.16 53.52,35.38 v53.34,35.56 53.34,40.96 C10.P$1 | 27.94,41.43 26.99,40.48 C8.P$1 26.86,34.8 26.86,30.68 27.49,30.05 U3.VDD 30.92,30.05 31.75,29.21 32.89,29.21 SJ1.2 | SJ2.2 2.25,28.96 1.27,29.94 1.27,36.35 3.42,38.5 | 3.42,38.5 R9.1 | v6.35,36.83 5.08,36.83 3.42,38.5 | C7.P$1 42.35,35.06 v45.09,35.06 | U2.VDD 9.47,30.05 v8.77,30.75
  Bottom 0.305: U9.6 6.35,58.42 7.62,57.15 10.16,57.15 12.06,55.25 v12.7,55.25 U7.4 U7.2 25.25,55.25 C4.+ 27.32,57.32 30.49,57.32 31.45,56.37 R20.2 34.29,56.37 | U1.20 11.09,37.1 11.73,37.1 12.16,36.67 12.16,35.87 11.77,35.47 U1.18 | U1.18 10.45,35.47 | 10.06,35.47 7.37,38.17 C11.P$1 7.37,37.85 v6.35,36.83 | 34.29,56.37 R19.2 | 34.29,56.37 34.29,52.07 v36.83,49.53 | U1.4 21.01,37.87 v23.15,40.01 | v53.34,35.56 50.8,35.56 48.26,38.1 45.87,38.1 R1.1 v45.09,35.06 | R21.1 R17.1 39.98,31.25 v39.62,31.25 | v8.77,30.75 8.65,30.88 8.65,34.05 10.06,35.47 | 10.06,35.47 | 10.06,35.47 U1.18

### Text on the board
tNames: U8 | PARASITE